# Altium schematic sheet controlled_boost_converter_ch0.SchDoc: Controlled Boost Converter CH0
size A3; Date: 2015-10-06; Author: Piotr Kuligowski; Revision: 1-0; SheetNumber: 5; SheetTotal: 8; Model: EM1
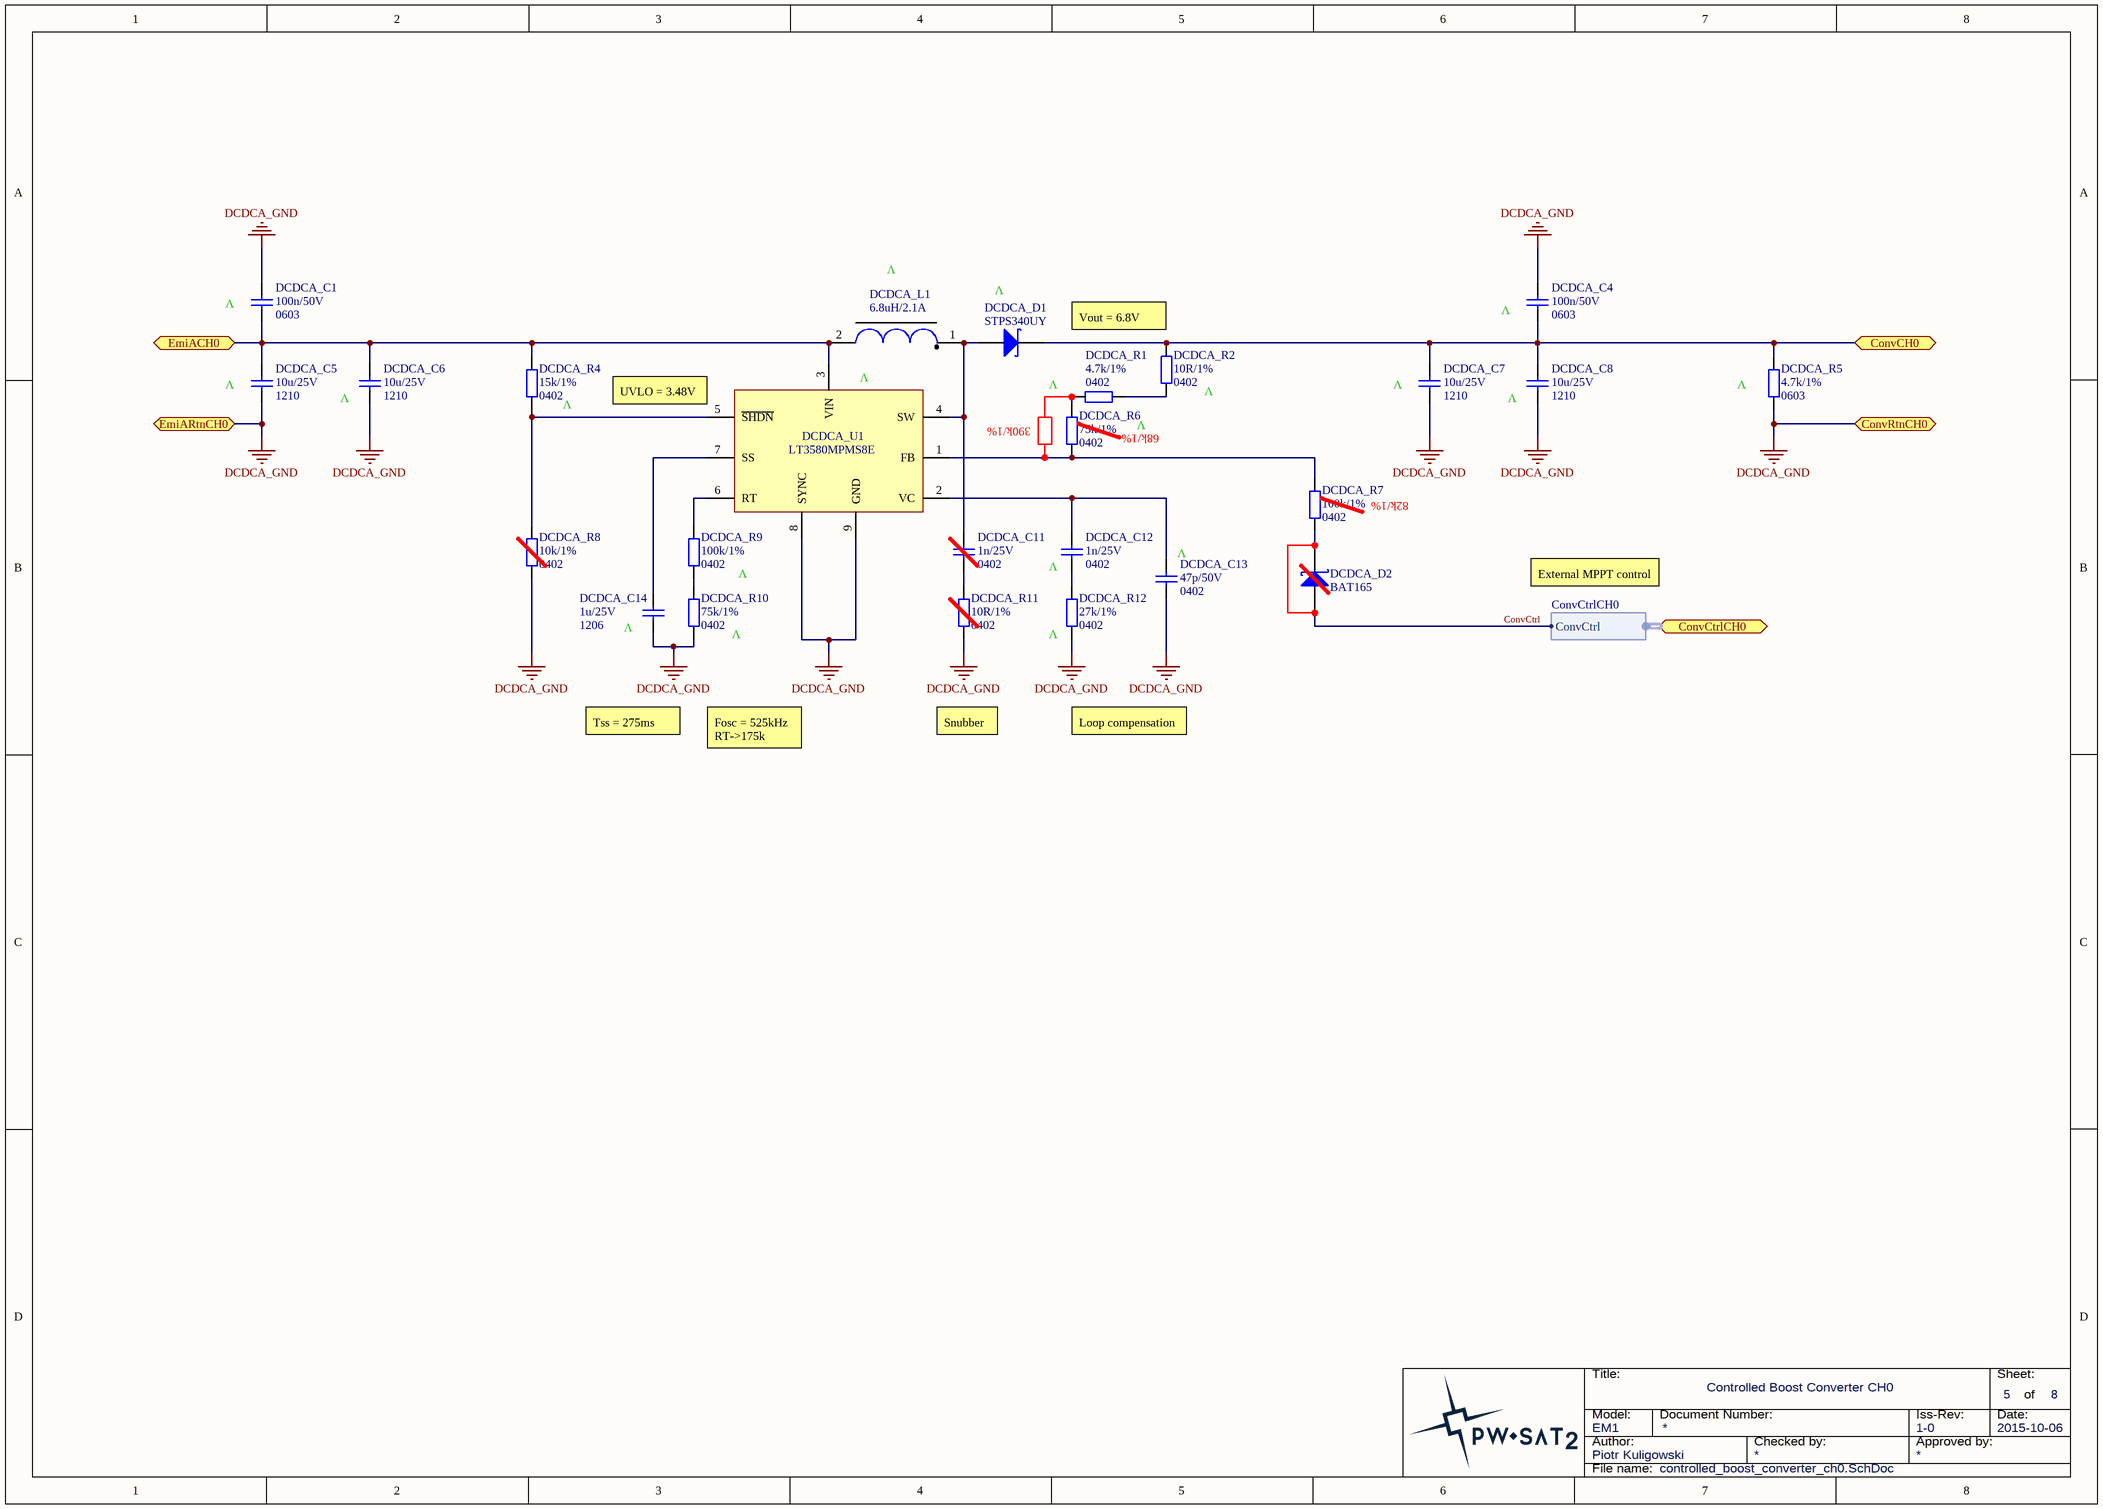
[diagram p0: controlled_boost_converter_ch0.SchDoc]

## Parts
DCDCA_C1  Package: 0603  [SMD_Capacitor_0603]  (hidden comment: 100n/50V)
DCDCA_C4  Package: 0603  [SMD_Capacitor_0603]  (hidden comment: 100n/50V)
DCDCA_C5  Package: 1210  [SMD_Capacitor_1210]  (hidden comment: 10u/25V)
DCDCA_C6  Package: 1210  [SMD_Capacitor_1210]  (hidden comment: 10u/25V)
DCDCA_C7  Package: 1210  [SMD_Capacitor_1210]  (hidden comment: 10u/25V)
DCDCA_C8  Package: 1210  [SMD_Capacitor_1210]  (hidden comment: 10u/25V)
DCDCA_C11  Package: 0402  [SMD_Capacitor_0402]  (hidden comment: 1n/25V)
DCDCA_C12  Package: 0402  [SMD_Capacitor_0402]  (hidden comment: 1n/25V)
DCDCA_C13  Package: 0402  [SMD_Capacitor_0402]  (hidden comment: 47p/50V)
DCDCA_C14  Package: 1206  [SMD_Capacitor_1206]  (hidden comment: 1u/25V)
DCDCA_D1  STPS340UY  [DO-214AA]
DCDCA_D2  BAT165  [SOD323]
DCDCA_L1  6.8uH/2.1A  [Coilcraft_MSS6132]
DCDCA_R1  Package: 0402  [SMD_Resistor_0402]  (hidden comment: 4.7k/1%)
DCDCA_R2  Package: 0402  [SMD_Resistor_0402]  (hidden comment: 10R/1%)
DCDCA_R4  Package: 0402  [SMD_Resistor_0402]  (hidden comment: 15k/1%)
DCDCA_R5  Package: 0603  [SMD_Resistor_0603]  (hidden comment: 4.7k/1%)
DCDCA_R6  Package: 0402  [SMD_Resistor_0402]  (hidden comment: 75k/1%)
DCDCA_R7  Package: 0402  [SMD_Resistor_0402]  (hidden comment: 100k/1%)
DCDCA_R8  Package: 0402  [SMD_Resistor_0402]  (hidden comment: 10k/1%)
DCDCA_R9  Package: 0402  [SMD_Resistor_0402]  (hidden comment: 100k/1%)
DCDCA_R10  Package: 0402  [SMD_Resistor_0402]  (hidden comment: 75k/1%)
DCDCA_R11  Package: 0402  [SMD_Resistor_0402]  (hidden comment: 10R/1%)
DCDCA_R12  Package: 0402  [SMD_Resistor_0402]  (hidden comment: 27k/1%)
DCDCA_U1  (no value)  [LT-MS8E-8-1880X1680TP_N]

## Ports
ConvCH0, ConvCtrlCH0 (harness ConvCtrlCH0), ConvRtnCH0, EmiACH0, EmiARtnCH0

## Harnesses
ConvCtrlCH0: ConvCtrl

## Nets
DCDCA_GND: DCDCA_C1.2 DCDCA_C4.2 DCDCA_C5.2 DCDCA_C6.2 DCDCA_C7.2 DCDCA_C8.2 DCDCA_C13.2 DCDCA_C14.2 DCDCA_R5.2 DCDCA_R8.2 DCDCA_R10.2 DCDCA_R11.2 DCDCA_R12.2 DCDCA_U1.8(SYNC) DCDCA_U1.9(GND) ; port EmiARtnCH0, port ConvRtnCH0
ConvCH0: DCDCA_C4.1 DCDCA_C7.1 DCDCA_C8.1 DCDCA_D1.K DCDCA_R2.1 DCDCA_R5.1 ; port ConvCH0
ConvCtrl: DCDCA_D2.A ; port ConvCtrlCH0.ConvCtrl
EmiACH0: DCDCA_C1.1 DCDCA_C5.1 DCDCA_C6.1 DCDCA_L1.2 DCDCA_R4.1 DCDCA_U1.3(VIN) ; port EmiACH0
NetDCDCA_C11_1: DCDCA_C11.1 DCDCA_D1.A DCDCA_L1.1 DCDCA_U1.4(SW)
NetDCDCA_C11_2: DCDCA_C11.2 DCDCA_R11.1
NetDCDCA_C12_1: DCDCA_C12.1 DCDCA_C13.1 DCDCA_U1.2(VC)
NetDCDCA_C12_2: DCDCA_C12.2 DCDCA_R12.1
NetDCDCA_C14_1: DCDCA_C14.1 DCDCA_U1.7(SS)
NetDCDCA_D2_K: DCDCA_D2.K DCDCA_R7.2
NetDCDCA_R1_1: DCDCA_R1.1 DCDCA_R6.1
NetDCDCA_R1_2: DCDCA_R1.2 DCDCA_R2.2
NetDCDCA_R4_2: DCDCA_R4.2 DCDCA_R8.1 DCDCA_U1.5(~{SHDN})
NetDCDCA_R6_2: DCDCA_R6.2 DCDCA_R7.1 DCDCA_U1.1(FB)
NetDCDCA_R9_1: DCDCA_R9.1 DCDCA_U1.6(RT)
NetDCDCA_R9_2: DCDCA_R9.2 DCDCA_R10.1

## Notes on the sheet
- (near DCDCA_C1) V
- V
- (near DCDCA_D1) V
- (near DCDCA_C4) V
- (near DCDCA_C5) V
- (near DCDCA_U1) V
- (near DCDCA_R2) Vout = 6.8V
- (near DCDCA_R2) V
- (near DCDCA_C7) V
- (near DCDCA_R5) V
- (near DCDCA_C6) V
- (near DCDCA_R4) V
- (near DCDCA_U1) UVLO = 3.48V
- 390k/1%
- 68k/1%
- (near DCDCA_C8) V
- 82k/1%
- (near DCDCA_C12) V
- (near DCDCA_C13) V
- External MPPT control
- (near DCDCA_C14) V
- (near DCDCA_R10) V
- (near DCDCA_R12) V
- Tss = 275ms
- Fosc = 525kHz
  RT->175k
- Snubber
- Loop compensation
- Title:
- Sheet:
- of
- Author:
- Model:
- Document Number:
- Checked by:
- Iss-Rev:
- Approved by:
- Date:
- File name:

## Library data of the parts
DCDCA_C1 DCDCA_C4 = Cer_C0603T104K5RALTU: Ceramic Cap Kemet COTS 100n/50V X7R 0603; Manufacturer: Kemet; ManufacturerPartNumber: C0603T104K5RALTU; Value: 100n/50V
DCDCA_C5-DCDCA_C8 = Cer_GCJ32ER71E106KA12L: Ceramic Cap Murata Automotive 10u/25V X7R 1210; Manufacturer: Murata; ManufacturerPartNumber: GCJ32ER71E106KA12L; Value: 10u/25V
DCDCA_C11 DCDCA_C12 = Cer_C0402T102K3GAL: Ceramic Cap Kemet COTS 1n/25V C0G 0402.; Manufacturer: Kemet; ManufacturerPartNumber: C0402T102K3GAL; Value: 1n/25V
DCDCA_C13 = Cer_GCM1555C1H470JA16D: Ceramic Cap Murata Automotive 47p/50V C0G 0402; Manufacturer: Murata; ManufacturerPartNumber: GCM1555C1H470JA16D; Value: 47p/50V
DCDCA_C14 = Cer_C1206T105K3RALTU: Ceramic Cap Kemet COTS 1u/25V X7R 1206; ManufacturerPartNumber: C1206T105K3RALTU; Manufacturer: Kemet; Value: 1u/25V
DCDCA_D1 = STPS340x: 3A/40V Power Schottky Rectifier.; Manufacturer: STMicroelectronics; Value: STPS340UY
DCDCA_D2 = BAT165: Madium Power AF Schottky 750mA 40V Diode; Manufacturer: Infineon; Value: BAT165
DCDCA_L1 = MSS6132-682MLx: Coilcraft MSS6132 Inductor, L=6.8uH, Irise20deg=2.1A, ESR=52mR, SRF=47MHz.; Manufacturer: Coilcraft; ManufacturerPartNumber: MSS6132-682MLx; Value: 6.8uH/2.1A
DCDCA_R1 = CRCW04024K70FKxxxx: 4.7k/1% Vishay CRCW 0402 Resistor. 63mW, 100ppm, 50V.; ManufacturerPartNumber: CRCW04024K70FKxxxx; Manufacturer: Vishay; Value: 4.7k/1%
DCDCA_R2 DCDCA_R11 = CRCW040210R0FKxxxx: 10R/1% Vishay CRCW 0402 Resistor. 63mW, 100ppm, 50V.; Manufacturer: Vishay; ManufacturerPartNumber: CRCW040210R0FKxxxx; Value: 10R/1%
DCDCA_R4 = CRCW040215K0FKxxxx: 15k/1% Vishay CRCW 0402 Resistor. 63mW, 100ppm, 50V.; Manufacturer: Vishay; ManufacturerPartNumber: CRCW040215K0FKxxxx; Value: 15k/1%
DCDCA_R5 = CRCW06034K70FKxxxx: 4.7k/1% Vishay CRCW 0603 Resistor. 100mW, 100ppm, 75V.; Manufacturer: Vishay; ManufactuerPartNumber: CRCW06034K70FKxxxx; Value: 4.7k/1%
DCDCA_R6 DCDCA_R10 = CRCW040275K0FKxxxx: 75k/1% Vishay CRCW 0402 Resistor. 63mW, 100ppm, 50V.; ManufacturerPartNumber: CRCW040275K0FK; Manufacturer: Vishay; Value: 75k/1%
DCDCA_R7 DCDCA_R9 = CRCW0402100KFKxxxx: 100k/1% Vishay CRCW 0402 Resistor. 63mW, 100ppm, 50V.; Manufacturer: Vishay; ManufacturerPartNumber: CRCW0402100KFKxxxx; Value: 100k/1%
DCDCA_R8 = CRCW040210K0FKxxxx: 10k/1% Vishay CRCW 0402 Resistor. 63mW, 100ppm, 50V.; Manufacturer: Vishay; ManufacturerPartNumber: CRCW040210K0FKxxxx; Value: 10k/1%
DCDCA_R12 = CRCW040227K0FKxxxx: 27k/1% Vishay CRCW 0402 Resistor. 63mW, 100ppm, 50V.; Manufacturer: Vishay; ManufacturerPartNumber: CRCW040227K0FKxxxx; Value: 27k/1%
DCDCA_U1 = LT3580MPMS8E: Boost Conv 2A, Soft-Start, Synchro; Manufacturer: Linear Technology; ManufacturerPartNumber: LT3580MPMS8E